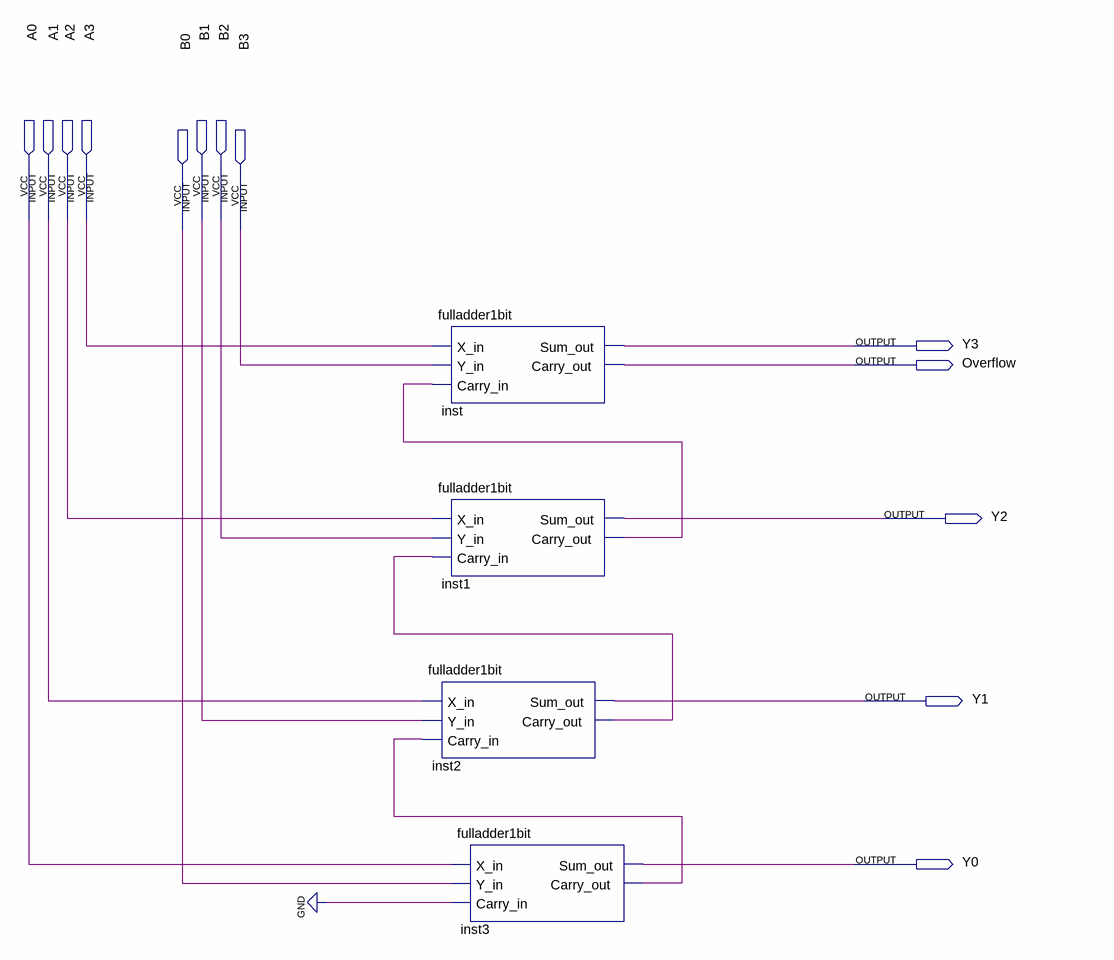
[diagram p0: schematic sheet]
// Quartus schematic arithcircuit4bits.bdf as structural Verilog: 4 symbols, 13 pins
module arithcircuit4bits (
  input  A0,
  input  A1,
  input  A2,
  input  A3,
  input  B1,
  input  B2,
  input  B0,
  input  B3,
  output Y3,
  output Overflow,
  output Y2,
  output Y1,
  output Y0
);

  wire inst1_carry_out, inst2_carry_out, inst3_carry_out;

  fulladder1bit inst (.X_in(A3), .Y_in(B3), .Carry_in(inst1_carry_out), .Sum_out(Y3), .Carry_out(Overflow));
  fulladder1bit inst1 (.X_in(A2), .Y_in(B2), .Carry_in(inst2_carry_out), .Sum_out(Y2), .Carry_out(inst1_carry_out));
  fulladder1bit inst2 (.X_in(A1), .Y_in(B1), .Carry_in(inst3_carry_out), .Sum_out(Y1), .Carry_out(inst2_carry_out));
  fulladder1bit inst3 (.X_in(A0), .Y_in(B0), .Carry_in(1'b0), .Sum_out(Y0), .Carry_out(inst3_carry_out));
endmodule
